# EAGLE design haasoscope_pro_power_board (EAGLE 9.6.2)
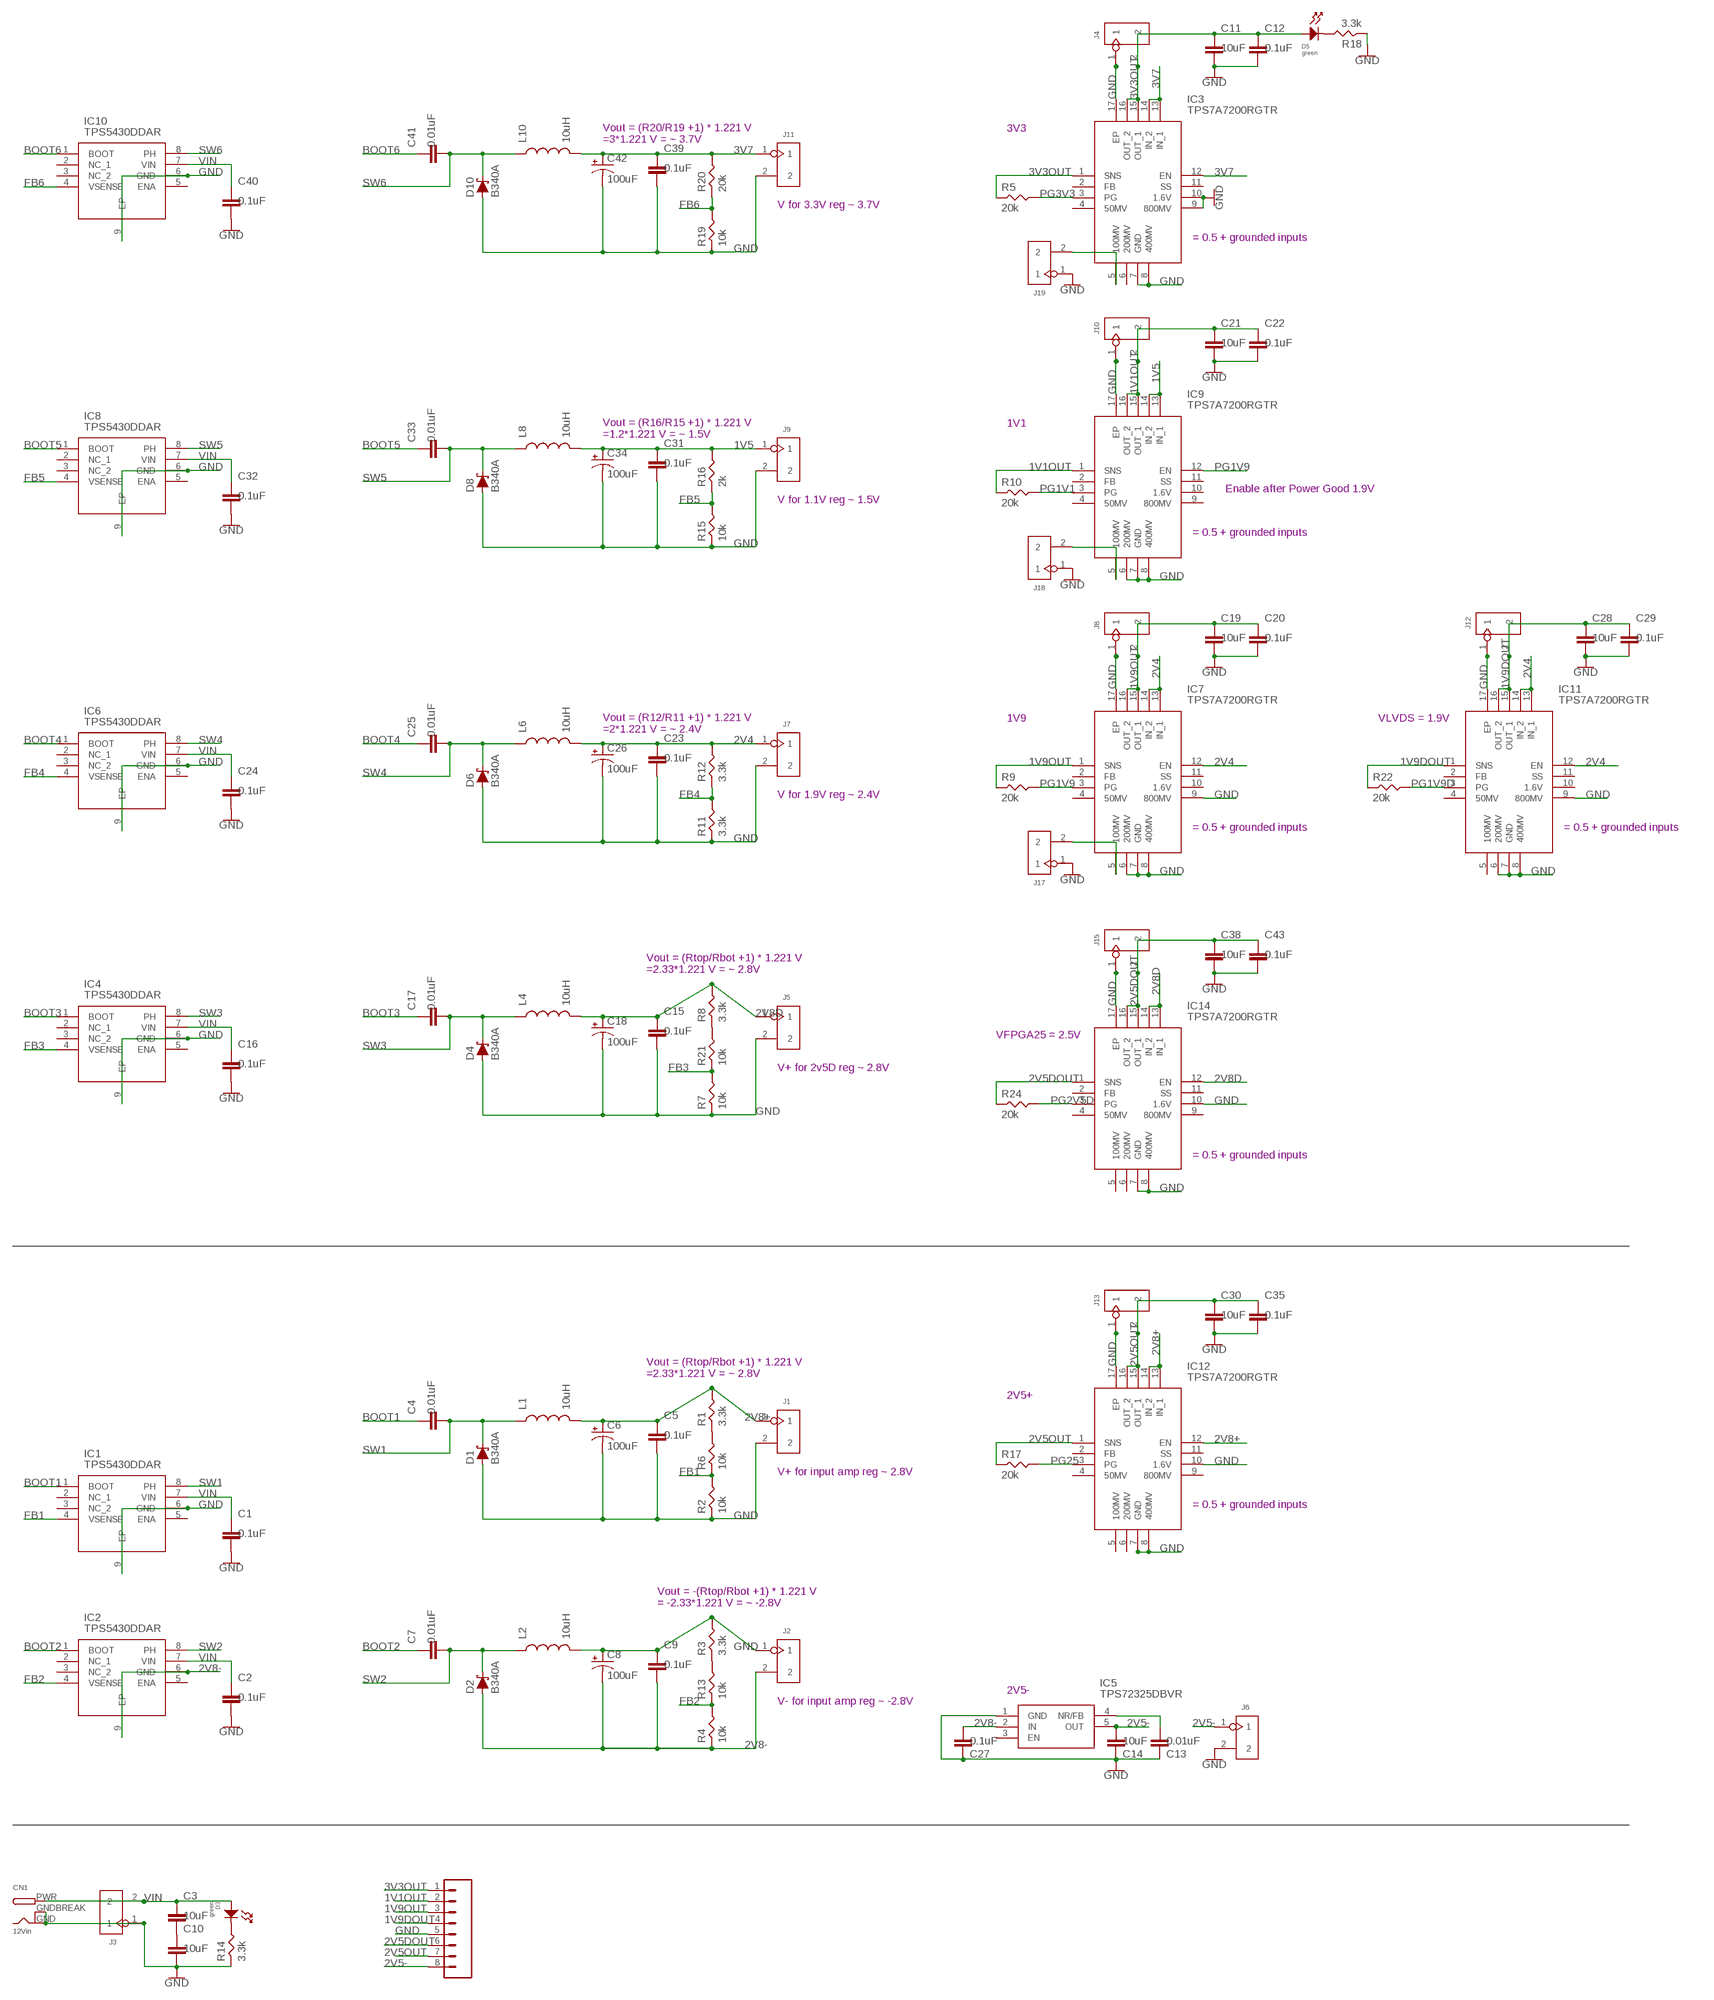
[diagram p0: schematic, sheet 1]

## Parts
C1  0.1uF  CAPACITOR_0402_N  [RESC0402_N]
C2  0.1uF  CAPACITOR_0402_N  [RESC0402_N]
C3  10uF  CAPACITOR_0805_N  [RESC0805_N]
C4  0.01uF  CAPACITOR_0402_N  [RESC0402_N]
C5  0.1uF  CAPACITOR_0402_N  [RESC0402_N]
C6  100uF  CAP_POLSMD  [VISHAY_C]
C7  0.01uF  CAPACITOR_0402_N  [RESC0402_N]
C8  100uF  CAP_POLSMD  [VISHAY_C]
C9  0.1uF  CAPACITOR_0402_N  [RESC0402_N]
C10  10uF  CAPACITOR_0805_N  [RESC0805_N]
C11  10uF  CAPACITOR_0805_N  [RESC0805_N]
C12  0.1uF  CAPACITOR_0402_N  [RESC0402_N]
C13  0.01uF  CAPACITOR_0402_N  [RESC0402_N]
C14  10uF  CAPACITOR_0805_N  [RESC0805_N]
C15  0.1uF  CAPACITOR_0402_N  [RESC0402_N]
C16  0.1uF  CAPACITOR_0402_N  [RESC0402_N]
C17  0.01uF  CAPACITOR_0402_N  [RESC0402_N]
C18  100uF  CAP_POLSMD  [VISHAY_C]
C19  10uF  CAPACITOR_0805_N  [RESC0805_N]
C20  0.1uF  CAPACITOR_0402_N  [RESC0402_N]
C21  10uF  CAPACITOR_0805_N  [RESC0805_N]
C22  0.1uF  CAPACITOR_0402_N  [RESC0402_N]
C23  0.1uF  CAPACITOR_0402_N  [RESC0402_N]
C24  0.1uF  CAPACITOR_0402_N  [RESC0402_N]
C25  0.01uF  CAPACITOR_0402_N  [RESC0402_N]
C26  100uF  CAP_POLSMD  [VISHAY_C]
C27  0.1uF  CAPACITOR_0402_N  [RESC0402_N]
C28  10uF  CAPACITOR_0805_N  [RESC0805_N]
C29  0.1uF  CAPACITOR_0402_N  [RESC0402_N]
C30  10uF  CAPACITOR_0805_N  [RESC0805_N]
C31  0.1uF  CAPACITOR_0402_N  [RESC0402_N]
C32  0.1uF  CAPACITOR_0402_N  [RESC0402_N]
C33  0.01uF  CAPACITOR_0402_N  [RESC0402_N]
C34  100uF  CAP_POLSMD  [VISHAY_C]
C35  0.1uF  CAPACITOR_0402_N  [RESC0402_N]
C38  10uF  CAPACITOR_0805_N  [RESC0805_N]
C39  0.1uF  CAPACITOR_0402_N  [RESC0402_N]
C40  0.1uF  CAPACITOR_0402_N  [RESC0402_N]
C41  0.01uF  CAPACITOR_0402_N  [RESC0402_N]
C42  100uF  CAP_POLSMD  [VISHAY_C]
C43  0.1uF  CAPACITOR_0402_N  [RESC0402_N]
CN1  12Vin  DCBARRELPTH  [DCJACK_2MM_PTH]
D1  B340A  DIODE-SCHOTTKY-B340A  [SMA-DIODE]
D2  B340A  DIODE-SCHOTTKY-B340A  [SMA-DIODE]
D3  green  LED_SINGLE-0805  [LED0805]
D4  B340A  DIODE-SCHOTTKY-B340A  [SMA-DIODE]
D5  green  LED_SINGLE-0805  [LED0805]
D6  B340A  DIODE-SCHOTTKY-B340A  [SMA-DIODE]
D8  B340A  DIODE-SCHOTTKY-B340A  [SMA-DIODE]
D10  B340A  DIODE-SCHOTTKY-B340A  [SMA-DIODE]
IC1  TPS5430DDAR  [SOIC127P600X170-9N]
IC2  TPS5430DDAR  [SOIC127P600X170-9N]
IC3  TPS7A7200RGTR  [QFN50P300X300X100-17N]
IC4  TPS5430DDAR  [SOIC127P600X170-9N]
IC5  TPS72325DBVR  [SOT95P280X145-5N]
IC6  TPS5430DDAR  [SOIC127P600X170-9N]
IC7  TPS7A7200RGTR  [QFN50P300X300X100-17N]
IC8  TPS5430DDAR  [SOIC127P600X170-9N]
IC9  TPS7A7200RGTR  [QFN50P300X300X100-17N]
IC10  TPS5430DDAR  [SOIC127P600X170-9N]
IC11  TPS7A7200RGTR  [QFN50P300X300X100-17N]
IC12  TPS7A7200RGTR  [QFN50P300X300X100-17N]
IC14  TPS7A7200RGTR  [QFN50P300X300X100-17N]
J1  2p-2.54  DIP-BLACK-MALE-HEADER-VERT(2P-2.54)  [H2-2.54]
J2  2p-2.54  DIP-BLACK-MALE-HEADER-VERT(2P-2.54)  [H2-2.54]
J3  2p-2.54  DIP-BLACK-MALE-HEADER-VERT(2P-2.54)  [H2-2.54]
J4  2p-2.54  DIP-BLACK-MALE-HEADER-VERT(2P-2.54)  [H2-2.54]
J5  2p-2.54  DIP-BLACK-MALE-HEADER-VERT(2P-2.54)  [H2-2.54]
J6  2p-2.54  DIP-BLACK-MALE-HEADER-VERT(2P-2.54)  [H2-2.54]
J7  2p-2.54  DIP-BLACK-MALE-HEADER-VERT(2P-2.54)  [H2-2.54]
J8  2p-2.54  DIP-BLACK-MALE-HEADER-VERT(2P-2.54)  [H2-2.54]
J9  2p-2.54  DIP-BLACK-MALE-HEADER-VERT(2P-2.54)  [H2-2.54]
J10  2p-2.54  DIP-BLACK-MALE-HEADER-VERT(2P-2.54)  [H2-2.54]
J11  2p-2.54  DIP-BLACK-MALE-HEADER-VERT(2P-2.54)  [H2-2.54]
J12  2p-2.54  DIP-BLACK-MALE-HEADER-VERT(2P-2.54)  [H2-2.54]
J13  2p-2.54  DIP-BLACK-MALE-HEADER-VERT(2P-2.54)  [H2-2.54]
J15  2p-2.54  DIP-BLACK-MALE-HEADER-VERT(2P-2.54)  [H2-2.54]
J16  8pin  CONN_08"  [1X08]
J17  2p-2.54  DIP-BLACK-MALE-HEADER-VERT(2P-2.54)  [H2-2.54]
J18  2p-2.54  DIP-BLACK-MALE-HEADER-VERT(2P-2.54)  [H2-2.54]
J19  2p-2.54  DIP-BLACK-MALE-HEADER-VERT(2P-2.54)  [H2-2.54]
L1  10uH  INDUCTORPWR  [CDRH125]
L2  10uH  INDUCTORPWR  [CDRH125]
L4  10uH  INDUCTORPWR  [CDRH125]
L6  10uH  INDUCTORPWR  [CDRH125]
L8  10uH  INDUCTORPWR  [CDRH125]
L10  10uH  INDUCTORPWR  [CDRH125]
R1  3.3k  RES-0402  [RES-0402]
R2  10k  RES-0402  [RES-0402]
R3  3.3k  RES-0402  [RES-0402]
R4  10k  RES-0402  [RES-0402]
R5  20k  RES-0402  [RES-0402]
R6  10k  RES-0402  [RES-0402]
R7  10k  RES-0402  [RES-0402]
R8  3.3k  RES-0402  [RES-0402]
R9  20k  RES-0402  [RES-0402]
R10  20k  RES-0402  [RES-0402]
R11  3.3k  RES-0402  [RES-0402]
R12  3.3k  RES-0402  [RES-0402]
R13  10k  RES-0402  [RES-0402]
R14  3.3k  RES-0402  [RES-0402]
R15  10k  RES-0402  [RES-0402]
R16  2k  RES-0402  [RES-0402]
R17  20k  RES-0402  [RES-0402]
R18  3.3k  RES-0402  [RES-0402]
R19  10k  RES-0402  [RES-0402]
R20  20k  RES-0402  [RES-0402]
R21  10k  RES-0402  [RES-0402]
R22  20k  RES-0402  [RES-0402]
R24  20k  RES-0402  [RES-0402]

## Nets
1V1OUT: C21.1 C22.1 IC9.1(SNS) IC9.15(OUT_1) IC9.16(OUT_2) J10.2 J16.2 R10.P$1
1V5: C31.1 C34.+ IC9.13(IN_1) IC9.14(IN_2) J9.1 L8.2 R16.P$2
1V9DOUT: C28.1 C29.1 IC11.1(SNS) IC11.15(OUT_1) IC11.16(OUT_2) J12.2 J16.4 R22.P$1
1V9OUT: C19.1 C20.1 IC7.1(SNS) IC7.15(OUT_1) IC7.16(OUT_2) J8.2 J16.3 R9.P$1
2V4: C23.1 C26.+ IC7.12(EN) IC7.13(IN_1) IC7.14(IN_2) IC11.12(EN) IC11.13(IN_1) IC11.14(IN_2) J7.1 L6.2 R12.P$2
2V5-: C14.1 IC5.5(OUT) J6.1 J16.8
2V5DOUT: C38.1 C43.1 IC14.1(SNS) IC14.15(OUT_1) IC14.16(OUT_2) J15.2 J16.6 R24.P$1
2V5OUT: C30.1 C35.1 IC12.1(SNS) IC12.15(OUT_1) IC12.16(OUT_2) J13.2 J16.7 R17.P$1
2V8+: C5.1 C6.+ IC12.12(EN) IC12.13(IN_1) IC12.14(IN_2) J1.1 L1.2 R1.P$2
2V8-: C8.- C9.2 C27.1 D2.A IC2.6(GND) IC2.9(EP) IC5.2(IN) J2.2 R4.P$1
2V8D: C15.1 C18.+ IC14.12(EN) IC14.13(IN_1) IC14.14(IN_2) J5.1 L4.2 R8.P$2
3V3OUT: C11.1 C12.1 D5.ANODE IC3.1(SNS) IC3.15(OUT_1) IC3.16(OUT_2) J4.2 J16.1 R5.P$1
3V7: C39.1 C42.+ IC3.12(EN) IC3.13(IN_1) IC3.14(IN_2) J11.1 L10.2 R20.P$2
BOOT1: C4.1 IC1.1(BOOT)
BOOT2: C7.1 IC2.1(BOOT)
BOOT3: C17.1 IC4.1(BOOT)
BOOT4: C25.1 IC6.1(BOOT)
BOOT5: C33.1 IC8.1(BOOT)
BOOT6: C41.1 IC10.1(BOOT)
FB1: IC1.4(VSENSE) R2.P$2 R6.P$1
FB2: IC2.4(VSENSE) R4.P$2 R13.P$1
FB3: IC4.4(VSENSE) R7.P$2 R21.P$1
FB4: IC6.4(VSENSE) R11.P$2 R12.P$1
FB5: IC8.4(VSENSE) R15.P$2 R16.P$1
FB6: IC10.4(VSENSE) R19.P$2 R20.P$1
GND: C1.2 C2.2 C5.2 C6.- C8.+ C9.1 C10.2 C11.2 C12.2 C13.2 C14.2 C15.2 C16.2 C18.- C19.2 C20.2 C21.2 C22.2 C23.2 C24.2 C26.- C27.2 C28.2 C29.2 C30.2 C31.2 C32.2 C34.- C35.2 C38.2 C39.2 C40.2 C42.- C43.2 CN1.GND CN1.GNDBREAK D1.A D4.A D6.A D8.A D10.A IC1.6(GND) IC1.9(EP) IC3.7(GND) IC3.8(400MV) IC3.9(800MV) IC3.10(1.6V) IC3.17(EP) IC4.6(GND) IC4.9(EP) IC5.1(GND) IC6.6(GND) IC6.9(EP) IC7.6(200MV) IC7.7(GND) IC7.8(400MV) IC7.9(800MV) IC7.17(EP) IC8.6(GND) IC8.9(EP) IC9.6(200MV) IC9.7(GND) IC9.8(400MV) IC9.17(EP) IC10.6(GND) IC10.9(EP) IC11.6(200MV) IC11.7(GND) IC11.8(400MV) IC11.9(800MV) IC11.17(EP) IC12.7(GND) IC12.8(400MV) IC12.10(1.6V) IC12.17(EP) IC14.7(GND) IC14.8(400MV) IC14.10(1.6V) IC14.17(EP) J1.2 J2.1 J3.1 J4.1 J5.2 J6.2 J7.2 J8.1 J9.2 J10.1 J11.2 J12.1 J13.1 J15.1 J16.5 J17.1 J18.1 J19.1 L2.2 R2.P$1 R3.P$2 R7.P$1 R11.P$1 R14.P$1 R15.P$1 R18.P$1 R19.P$1
N$1: R1.P$1 R6.P$2
N$2: R3.P$1 R13.P$2
N$3: C3.2 C10.1
N$4: C13.1 IC5.4(NR/FB)
N$5: D3.CATHODE R14.P$2
N$6: D5.CATHODE R18.P$2
N$7: R8.P$1 R21.P$2
N$8: IC3.5(100MV) J19.2
N$9: IC9.5(100MV) J18.2
N$10: IC7.5(100MV) J17.2
PG1V1: IC9.3(PG) R10.P$2
PG1V9: IC7.3(PG) IC9.12(EN) R9.P$2
PG1V9D: IC11.3(PG) R22.P$2
PG2V5D: IC14.3(PG) R24.P$2
PG3V3: IC3.3(PG) R5.P$2
PG25: IC12.3(PG) R17.P$2
SW1: C4.2 D1.C IC1.8(PH) L1.1
SW2: C7.2 D2.C IC2.8(PH) L2.1
SW3: C17.2 D4.C IC4.8(PH) L4.1
SW4: C25.2 D6.C IC6.8(PH) L6.1
SW5: C33.2 D8.C IC8.8(PH) L8.1
SW6: C41.2 D10.C IC10.8(PH) L10.1
VIN: C1.1 C2.1 C3.1 C16.1 C24.1 C32.1 C40.1 CN1.PWR D3.ANODE IC1.7(VIN) IC2.7(VIN) IC4.7(VIN) IC6.7(VIN) IC8.7(VIN) IC10.7(VIN) J3.2
Unconnected: IC1.2(NC_1) IC1.3(NC_2) IC1.5(ENA) IC2.2(NC_1) IC2.3(NC_2) IC2.5(ENA) IC3.2(FB) IC3.4(50MV) IC3.6(200MV) IC3.11(SS) IC4.2(NC_1) IC4.3(NC_2) IC4.5(ENA) IC5.3(EN) IC6.2(NC_1) IC6.3(NC_2) IC6.5(ENA) IC7.2(FB) IC7.4(50MV) IC7.10(1.6V) IC7.11(SS) IC8.2(NC_1) IC8.3(NC_2) IC8.5(ENA) IC9.2(FB) IC9.4(50MV) IC9.9(800MV) IC9.10(1.6V) IC9.11(SS) IC10.2(NC_1) IC10.3(NC_2) IC10.5(ENA) IC11.2(FB) IC11.4(50MV) IC11.5(100MV) IC11.10(1.6V) IC11.11(SS) IC12.2(FB) IC12.4(50MV) IC12.5(100MV) IC12.6(200MV) IC12.9(800MV) IC12.11(SS) IC14.2(FB) IC14.4(50MV) IC14.5(100MV) IC14.6(200MV) IC14.9(800MV) IC14.11(SS)

## Notes on the sheet
- 3V3
- Vout = (R20/R19 +1) * 1.221 V
  =3*1.221 V = ~ 3.7V
- V for 3.3V reg ~ 3.7V
- = 0.5 + grounded inputs
- 1V1
- Vout = (R16/R15 +1) * 1.221 V
  =1.2*1.221 V = ~ 1.5V
- Enable after Power Good 1.9V
- V for 1.1V reg ~ 1.5V
- = 0.5 + grounded inputs
- 1V9 | VLVDS = 1.9V
- Vout = (R12/R11 +1) * 1.221 V
  =2*1.221 V = ~ 2.4V
- V for 1.9V reg ~ 2.4V
- = 0.5 + grounded inputs | = 0.5 + grounded inputs
- Vout = (Rtop/Rbot +1) * 1.221 V
  =2.33*1.221 V = ~ 2.8V
- VFPGA25 = 2.5V
- V+ for 2v5D reg ~ 2.8V
- = 0.5 + grounded inputs
- Vout = (Rtop/Rbot +1) * 1.221 V
  =2.33*1.221 V = ~ 2.8V
- 2V5+
- V+ for input amp reg ~ 2.8V
- = 0.5 + grounded inputs
- Vout = -(Rtop/Rbot +1) * 1.221 V
  = -2.33*1.221 V = ~ -2.8V
- 2V5-
- V- for input amp reg ~ -2.8V

## Library data of the parts
C1-C5 C7 C9-C17 C19-C25 C27-C33 C35 C38-C41 C43 = Nordic_nRF:CAPACITOR: Generic chip capacitor
C6 C8 C18 C26 C34 C42 = SparkFun-Passives:CAP_POL: Capacitor Polarized These are standard SMD and PTH capacitors. Normally 10uF, 47uF, and 100uF in electrolytic and tantalum varieties. Always verify the external diameter of the through hole cap, it varies with capacity, voltage, and manufacturer. The EIA devices should be standard.; LCSC: C7230
CN1 = adafruit:DCBARREL: 2.0mm DC Barrel Jack DCJACK_2MM_PTH - Through Hole Jack (4UConnector: 05537)
D1 D2 D4 D6 D8 D10 = SparkFun-DiscreteSemi:DIODE-SCHOTTKY: Schottky diode A Schottky diode is a semiconductor diode which has a low forward voltage drop and a very fast switching action.; LCSC: C64982; PROD_ID: DIO-09886; VALUE: 3A/40V/500mV
D3 D5 = MF_LEDs:LED_SINGLE: Library: MF_LEDs Description: Device for Single LED Packages. Manufacture part number (MFG#) can be added via Attributes.; HOUSEPART: NO; POPULATE: 1
IC1 IC2 IC4 IC6 IC8 IC10 = TPS5430DDAR:TPS5430DDAR: Texas Instruments, TPS5430DDAR Step-Down Switching Regulator 3A Adjustable, 1.22 31 V, 8-Pin SOIC Source: Datasheet <http://www.ti.com/lit/gpn/tps5430>; DESCRIPTION: Texas Instruments, TPS5430DDAR Step-Down Switching Regulator 3A Adjustable, 1.22 31 V, 8-Pin SOIC; HEIGHT: 1.7mm; MANUFACTURER_NAME: Texas Instruments; MANUFACTURER_PART_NUMBER: TPS5430DDAR; MOUSER_PART_NUMBER: 595-TPS5430DDAR; MOUSER_PRICE-STOCK: https://www.mouser.co.uk/ProductDetail/Texas-Instruments/TPS5430DDAR?qs=zwk82MlA57ZJdOTovH1aYA%3D%3D
IC3 IC7 IC9 IC11 IC12 IC14 = TPS7A7200RGTR:TPS7A7200RGTR: 2A, Single Output, Very Low Input, Configurable Fixed (0.9 to 5.0V) Low-Dropout Linear Regulator Source: Datasheet <http://www.ti.com/lit/gpn/tps7a7200>; DESCRIPTION: 2A, Single Output, Very Low Input, Configurable Fixed (0.9 to 5.0V) Low-Dropout Linear Regulator; HEIGHT: 1mm; MANUFACTURER_NAME: Texas Instruments; MANUFACTURER_PART_NUMBER: TPS7A7200RGTR; MOUSER_PART_NUMBER: 595-TPS7A7200RGTR; MOUSER_PRICE-STOCK: https://www.mouser.co.uk/ProductDetail/Texas-Instruments/TPS7A7200RGTR?qs=N%2FGwOzoYEADhZqusv3bivA%3D%3D
IC5 = TPS72325DBVR:TPS72325DBVR: TEXAS INSTRUMENTS - TPS72325DBVR - LDO, FIXED, -2.5V, 0.2A, SOT-23-5 Source: Datasheet <https://datasheet.datasheetarchive.com/originals/distributors/Datasheets-SFU2/DSASFU100034060.pdf>; DESCRIPTION: TEXAS INSTRUMENTS - TPS72325DBVR - LDO, FIXED, -2.5V, 0.2A, SOT-23-5; HEIGHT: 1.45mm; MANUFACTURER_NAME: Texas Instruments; MANUFACTURER_PART_NUMBER: TPS72325DBVR; MOUSER_PART_NUMBER: 595-TPS72325DBVR; MOUSER_PRICE-STOCK: https://www.mouser.co.uk/ProductDetail/Texas-Instruments/TPS72325DBVR?qs=6zVL%252ByCp0mrCtYCk6%2F08lw%3D%3D
J1-J13 J15 J17-J19 = Seeed-Connector:DIP-BLACK-MALE-HEADER-VERT(2P-2.54): 320020016; MPN: P125-1102A0BS116A1
J16 = SparkFun-Connectors:CONN_08: Multi connection point. Often used as Generic Header-pin footprint for 0.1 inch spaced/style header connections On any of the 0.1 inch spaced packages, you can populate with these: Break Away Headers - Straight <https://www.sparkfun.com/products/116> (PRT-00116) Break Away Male Headers - Right Angle <https://www.sparkfun.com/products/553> (PRT-00553) Female Headers <https://www.sparkfun.com/products/115> (PRT-00115) Break Away Headers - Machine Pin <https://www.sparkfun.com/products/117> (PRT-00117) Break Away Female Headers - Swiss Machine Pin <https://www.sparkfun.com/products/743> (PRT-00743) Arduino Stackable Header - 8 Pin <https://www.sparkfun.com/products/9279> (PRT-09279) For SCREWTERMINALS and SPRING TERMINALS visit here: Screw Terimnals on SparkFun.com <https://www.sparkfun.com/search/results?term=Screw+Terminals> (5mm/3.5mm/2.54mm spacing) This device is also useful as a general connection point to wire up your design to another part of your project. Our various solder wires solder well into these plated through hole pads. Hook-Up Wire - Assortment (Stranded, 22 AWG) <https://www.sparkfun.com/products/11375> (PRT-11375) Hook-Up Wire - Assortment (Solid Core, 22 AWG) <https://www.sparkfun.com/products/11367> (PRT-11367) View the entire wire category on our website here <https://www.sparkfun.com/categories/141> Special notes: Molex polarized connector foot print use with SKU : PRT-08231 with associated crimp pins and housings. 1MM SMD Version SKU: PRT-10208 NOTES ON THE VARIANTS LOCK and LOCK_LONGPADS... This footprint was designed to help hold the alignment of a through-hole component (i.e. 6-pin header) while soldering it into place. You may notice that each hole has been shifted either up or down by 0.005 of an inch from it's more standard position (which is a perfectly straight line). This slight alteration caused the pins (the squares in the middle) to touch the edges of the holes. Because they are alternating, it causes a "brace" to hold the component in place. 0.005 has proven to be the perfect amount of "off-center" position when using our standard breakaway headers. Although looks a little odd when you look at the bare footprint, once you have a header in there, the alteration is very hard to notice. Also,if you push a header all the way into place, it is covered up entirely on the bottom side.; PROD_ID: CONN-08438
L1 L2 L4 L6 L8 L10 = SparkFun-Passives:INDUCTOR: Inductors Basic Inductor/Choke - 0603 and 1206. Footprints are not proven and vary greatly between part numbers. INDUCTOR POWER 3.3UH 4.0A SMD 0.197" L x 0.197" W x 0.177" H (5.00mm x 5.00mm x 4.50mm); LCSC: C339970
R1-R22 R24 = FlashPCB_Resistors:RES-0402: https://www.digikey.com/en/products/filter/chip-resistor-surface-mount/52?s=N4IgjCBcpgbFoDGUBmBDANgZwKYBoQB7KAbRAGYBOAJgBZ4BdAgBwBcoQBlVgJwEsAdgHMQAX1EFqpEDxxY%2BWVoR4gGooA

## Net classes
0 default: width 0.305 mm
1 power: width 0.406 mm
2 gnd: width 0.305 mm

## Board
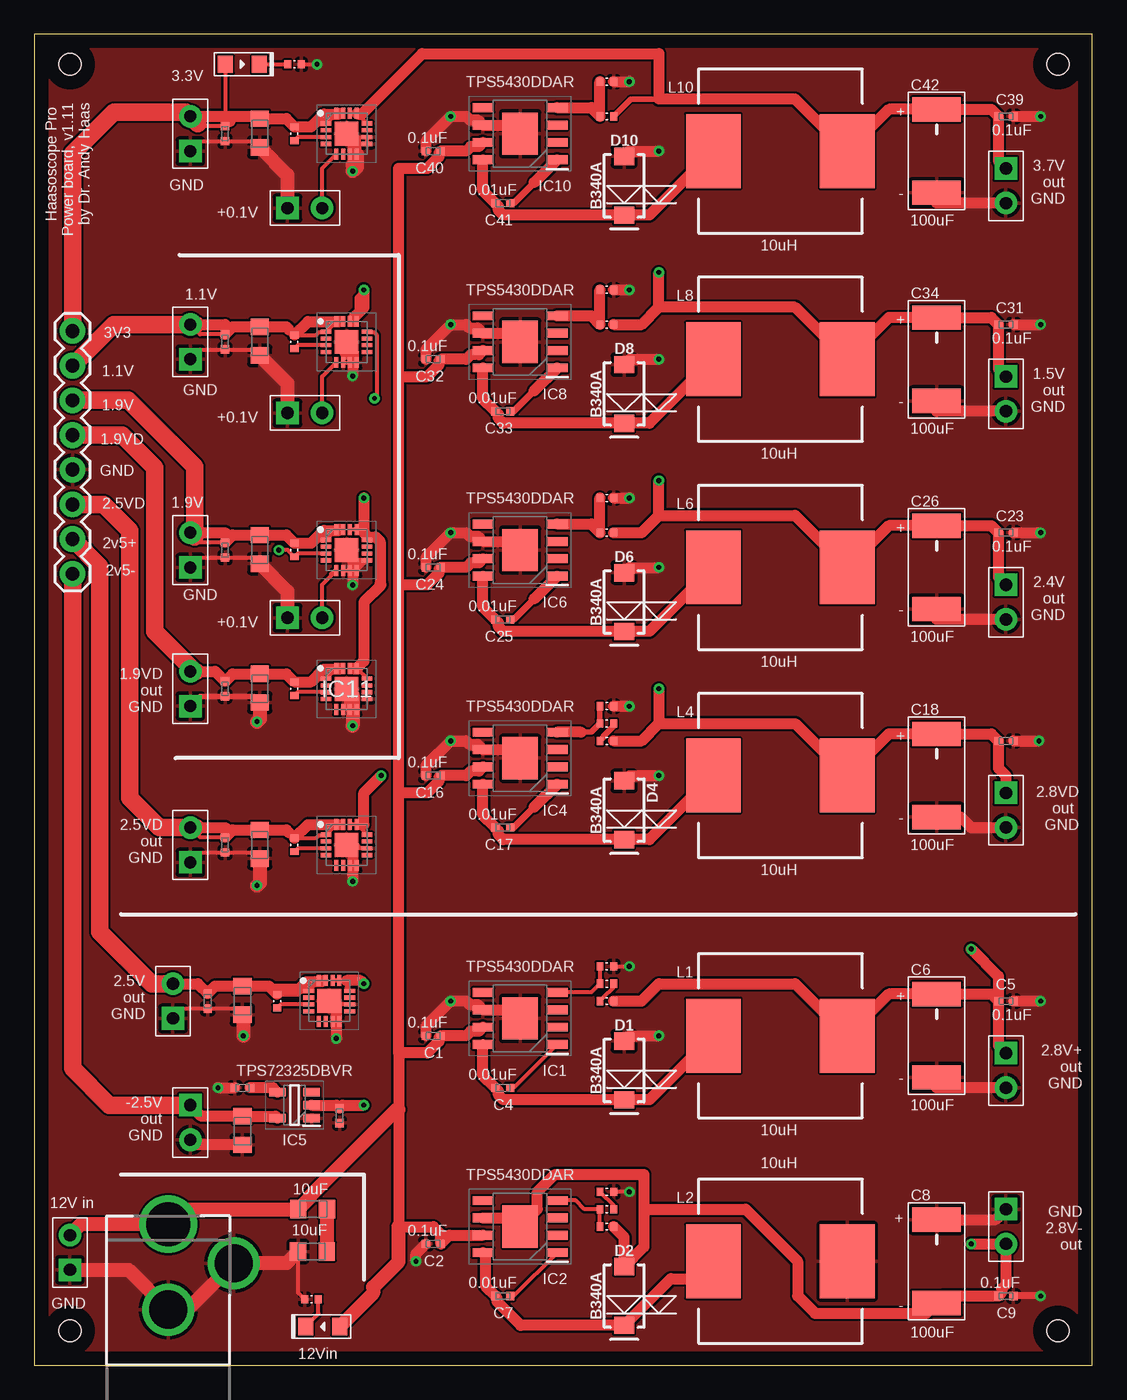
[diagram p1: board, top side]
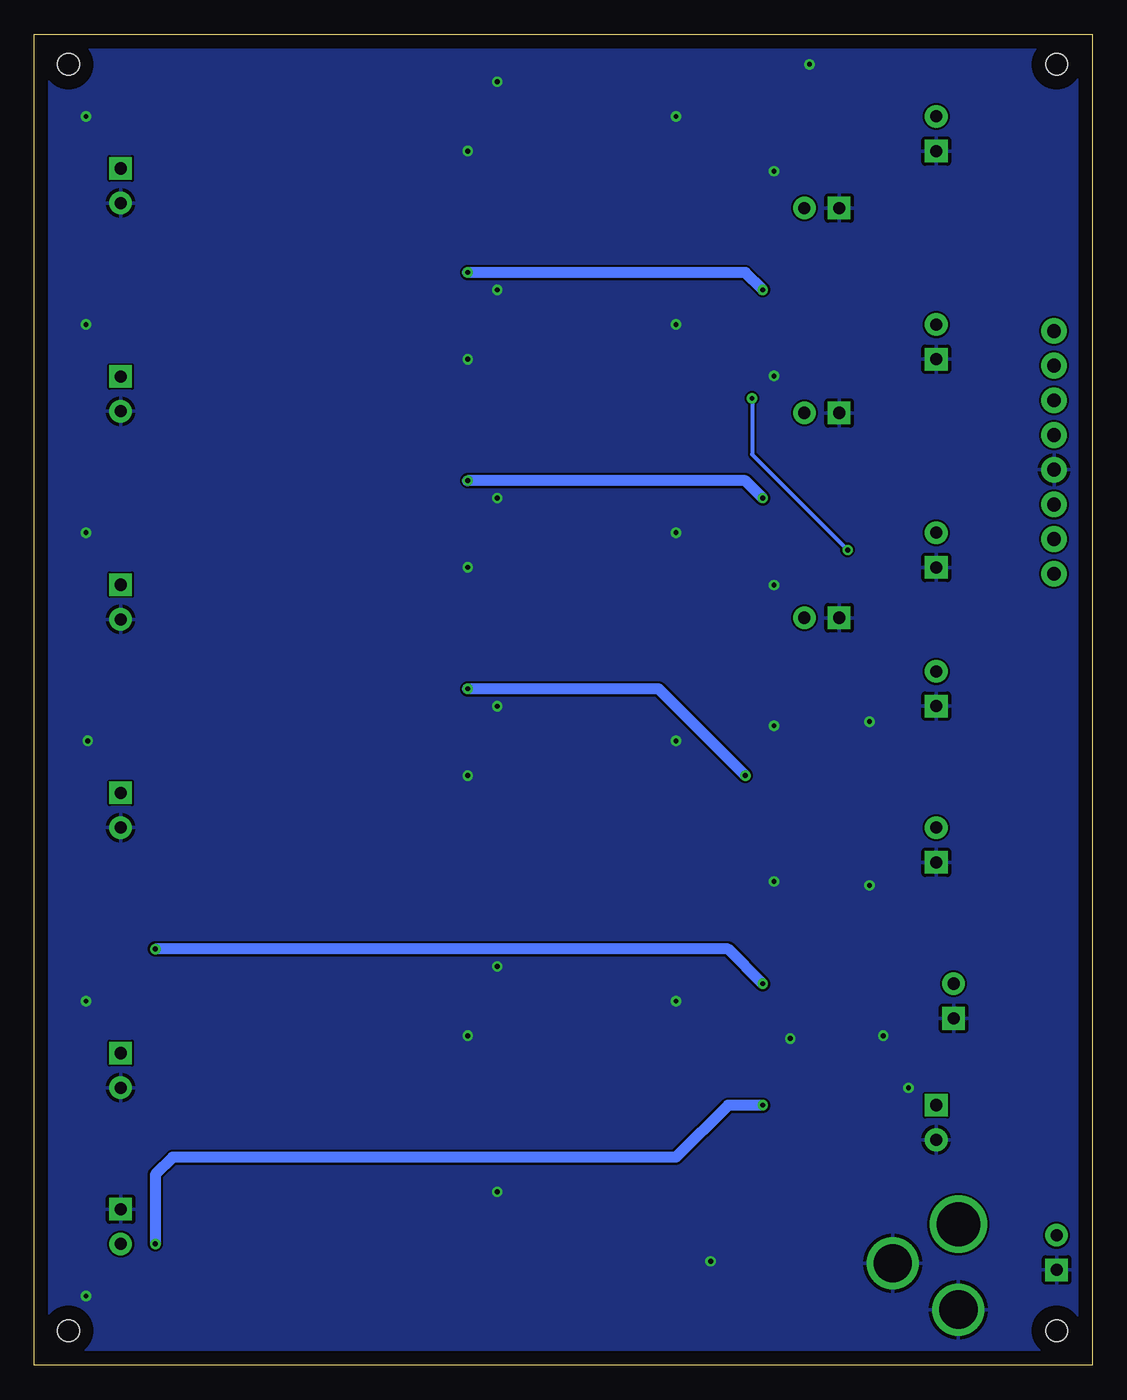
[diagram p2: board, bottom side, seen from below]

Size 77.45 x 97.46 mm. Coordinates in mm from the lower left corner, seen from the top.
Outline: 0,0 77.45,0 77.45,97.46 0,97.46 0,0
Copper layers (1*16): Top 0.035mm / dielectric 1.5mm / Bottom 0.035mm
Design rules "default": minimum track width 6mil, minimum drill 0.35mm, track to track 6mil, track to pad 6mil, pad to pad 6mil, via to via 6mil, smd to smd 6mil, copper to edge 40mil, drill to drill 6mil, minimum pad ring 10mil, minimum via ring 8mil, stop-mask expansion 4mil, vias tented up to drill 0mil, thermal gap 10mil
Holes 1.6 mm at 2.62,95.25 2.62,2.54 74.93,2.54 74.93,95.25

### Footprints (pad centres in the part's own frame; a part is rotated, then mirrored left to right if it is on the bottom)
RESC0402_N = smd 0.6 x 0.6: 1 -0.55,0; 2 0.55,0
RESC0805_N = smd 1.2 x 1.35: 1 -1.1,0; 2 1,0
VISHAY_C = smd 3.556 x 1.778: + 0,3.048; - 0,-3.048
DCJACK_2MM_PTH = drill 2.8: GND 0,7.35; GNDBREAK 4.8,10.75 | drill 3.2: PWR 0,13.6
SMA-DIODE = smd 1.27 x 1.47: A -2.15,0; C 2.15,0
LED0805 = smd 1.1 x 1.25: ANODE 1.25,0; CATHODE -1.25,0
SOIC127P600X170-9N = smd 1.525 x 0.65: 1 -2.712,1.905; 2 -2.712,0.635; 3 -2.712,-0.635; 4 -2.712,-1.905; 5 2.712,-1.905; 6 2.712,-0.635; 7 2.712,0.635; 8 2.712,1.905 | smd 2.6 x 3.1: 9 0,0
QFN50P300X300X100-17N = smd 0.8 x 0.3: 1 -1.5,0.75; 2 -1.5,0.25; 3 -1.5,-0.25; 4 -1.5,-0.75; 9 1.5,-0.75; 10 1.5,-0.25; 11 1.5,0.25; 12 1.5,0.75 | smd 0.3 x 0.8: 5 -0.75,-1.5; 6 -0.25,-1.5; 7 0.25,-1.5; 8 0.75,-1.5; 13 0.75,1.5; 14 0.25,1.5; 15 -0.25,1.5; 16 -0.75,1.5 | smd 1.75 x 1.75: 17 0,0
SOT95P280X145-5N = smd 1.2 x 0.6: 1 -1.25,0.95; 2 -1.25,0; 3 -1.25,-0.95; 4 1.25,-0.95; 5 1.25,0.95
H2-2.54 = drill 0.889 pad 1.651 square: 1 0,1.27 | drill 0.889 pad 1.651: 2 0,-1.27
1X08 = drill 1.016 pad 1.88: 1 0,0; 2 2.54,0; 3 5.08,0; 4 7.62,0; 5 10.16,0; 6 12.7,0; 7 15.24,0; 8 17.78,0
CDRH125 = smd 5.4 x 4: 1 0,4.9; 2 0,-4.9
RES-0402 = smd 0.5 x 0.6: P$1 -0.5,0; P$2 0.5,0

### Placement (x,y rotation side)
C1  29.21,24.13 180 top
C2  29.21,8.89 180 top
C3  20.43,11.43 0 top
C4  34.29,20.32 180 top
C5  71.12,26.67 0 top
C6  66.04,24.13 0 top
C7  34.29,5.08 180 top
C8  66.04,7.62 0 top
C9  71.12,5.08 180 top
C10  20.31,8.33 180 top
C11  16.51,90.17 270 top
C12  13.97,90.17 270 top
C13  15.24,20.32 180 top
C14  15.24,17.14 270 top
C15  71.12,45.72 0 top
C16  29.21,43.18 180 top
C17  34.29,39.37 180 top
C18  66.04,43.18 0 top
C19  16.51,59.69 270 top
C20  13.97,59.69 270 top
C21  16.51,74.93 270 top
C22  13.97,74.93 270 top
C23  71.12,60.96 0 top
C24  29.21,58.42 180 top
C25  34.29,54.61 180 top
C26  66.04,58.42 0 top
C27  22.35,18.29 270 top
C28  16.51,49.53 270 top
C29  13.97,49.53 270 top
C30  15.24,26.67 270 top
C31  71.12,76.2 0 top
C32  29.21,73.66 180 top
C33  34.29,69.85 180 top
C34  66.04,73.66 0 top
C35  12.7,26.67 270 top
C38  16.51,38.1 270 top
C39  71.12,91.44 0 top
C40  29.21,88.9 180 top
C41  34.29,85.09 180 top
C42  66.04,88.9 0 top
C43  13.97,38.1 270 top
CN1  9.81,-3.27 0 top
D1  43.18,21.59 270 top
D2  43.18,5.08 270 top
D3  21.11,2.84 0 top
D4  43.18,40.64 270 top
D5  15.24,95.25 180 top
D6  43.18,55.88 270 top
D8  43.18,71.12 270 top
D10  43.18,86.36 270 top
IC1  35.56,25.4 180 top
IC2  35.56,10.16 180 top
IC3  22.86,90.17 0 top
IC4  35.56,44.45 180 top
IC5  19.05,19.05 180 top
IC6  35.56,59.69 180 top
IC7  22.86,59.69 0 top
IC8  35.56,74.93 180 top
IC9  22.86,74.93 0 top
IC10  35.56,90.17 180 top
IC11  22.86,49.53 0 top
IC12  21.59,26.67 0 top
IC14  22.86,38.1 0 top
J1  71.12,21.59 0 top
J2  71.12,10.16 0 top
J3  2.62,8.26 180 top
J4  11.43,90.17 180 top
J5  71.12,40.64 0 top
J6  11.43,17.78 0 top
J7  71.12,55.88 0 top
J8  11.43,59.69 180 top
J9  71.12,71.12 0 top
J10  11.43,74.93 180 top
J11  71.12,86.36 0 top
J12  11.43,49.53 180 top
J13  10.16,26.67 180 top
J15  11.43,38.1 180 top
J16  2.81,75.73 270 top
J17  19.81,54.73 90 top
J18  19.81,69.73 90 top
J19  19.81,84.73 90 top
L1  54.61,24.13 90 top
L2  54.61,7.62 90 top
L4  54.61,43.18 90 top
L6  54.61,58.42 90 top
L8  54.61,73.66 90 top
L10  54.61,88.9 90 top
R1  41.91,26.67 0 top
R2  41.91,29.21 180 top
R3  41.91,12.7 0 top
R4  41.91,10.16 180 top
R5  19.05,90.17 270 top
R6  41.91,27.94 0 top
R7  41.91,48.26 180 top
R8  41.91,45.72 0 top
R9  19.05,59.69 270 top
R10  19.05,74.93 270 top
R11  41.91,63.5 180 top
R12  41.91,60.96 0 top
R13  41.91,11.43 0 top
R14  20.3,4.84 0 top
R15  41.91,78.74 180 top
R16  41.91,76.2 0 top
R17  17.78,26.67 270 top
R18  19.05,95.25 180 top
R19  41.91,93.98 180 top
R20  41.91,91.44 0 top
R21  41.91,46.99 0 top
R22  19.05,49.53 270 top
R24  19.05,38.1 270 top

### Tracks (layer width: path | path; a pad name or v marks a point on that pad's centre or on a via)
1V1OUT
  Top 0.305: 18.66,75.81 R10.P$1 20.63,75.43 20.83,75.64 21.31,75.64 IC9.1 IC9.16 22.36,76.43 IC9.15 | 14.52,76.03 14.33,75.84 C22.1 12.15,75.48 11.86,75.78 J10.2
  Top 0.813: J10.2 11.81,76.2 13.97,76.2 14.33,75.84 | C22.1 14.52,76.03 C21.1 18.45,76.03 18.66,75.81 | R10.P$1 20.05,76.43 22.36,76.43
  Top 1.27: J16.2 5.82,76.2 11.81,76.2
1V5  (via drill 0.35)
  Top 0.305: IC9.14 23.32,76.43 IC9.13 23.61,78.22 v24.13,78.74
  Top 0.813: R16.P$2 44.45,76.2 45.72,77.47 | 45.72,77.47 55.7,77.47 L8.2 62.56,76.71 C34.+ 70.06,76.71 C31.1 70.57,72.94 J9.1 | 45.72,77.47 v45.72,80.01 | v24.13,78.74 24.13,77.45 23.32,76.64 23.32,76.43
  Bottom 0.813: v24.13,78.74 25.4,80.01 v45.72,80.01
1V9DOUT
  Top 0.305: R22.P$1 20.63,50.03 20.83,50.23 21.31,50.23 IC11.1 IC11.16 22.4,51.03 IC11.15
  Top 0.813: J12.2 11.81,50.8 13.25,50.8 C29.1 14.52,50.63 C28.1 18.45,50.63 R22.P$1 20.27,50.03 21.2,50.96 22.33,50.96 22.4,51.03
  Top 1.27: J16.4 6.43,68.11 8.81,65.73 8.81,53.73 11.74,50.8 11.81,50.8
1V9OUT
  Top 0.305: R9.P$1 20.63,60.19 20.83,60.39 21.31,60.39 IC7.1 IC7.16 22.4,61.19 IC7.15 | 14.52,60.79 14.33,60.6 C20.1 12.15,60.24 11.73,60.65 J8.2
  Top 0.813: J8.2 13.81,60.96 13.97,60.96 14.33,60.6 | C20.1 14.52,60.79 C19.1 18.46,60.79 R9.P$1 20.27,60.19 21.2,61.12 22.33,61.12 22.4,61.19
  Top 1.27: J16.3 6.89,70.65 11.73,65.81 11.73,60.65
2V4  (via drill 0.35)
  Top 0.305: IC7.12 23.98,60.81 | 23.98,60.81 IC7.13 | IC7.13 IC7.14 | IC7.13 24.13,61.19 v24.13,63.5 | IC11.13 23.36,51.03 IC11.14 IC11.13 | 24.13,55.88 25.4,57.15 25.4,59.88 24.47,60.81 23.98,60.81 | IC11.12 IC11.13
  Top 0.813: R12.P$2 44.45,60.96 45.72,62.23 | 45.72,62.23 55.7,62.23 L6.2 62.56,61.47 C26.+ 70.06,61.47 C23.1 70.57,57.7 J7.1 | 45.72,62.23 v45.72,64.77 | v24.13,63.5 24.13,60.96 24.44,60.65 24.99,60.65 25.32,60.32 25.32,57.23 | 25.32,57.23 25.4,57.15 | 25.32,57.23 25.32,57.07 24.13,55.88 24.13,51.55 IC11.13 23.68,50.96 23.43,50.96 23.36,51.03
  Bottom 0.813: v45.72,64.77 25.4,64.77 v24.13,63.5
2V5-
  Top 0.813: J6.1 12.24,18.25 C14.1 17.66,18.25 IC5.5
  Top 1.27: J16.8 2.81,21.73 5.49,19.05 J6.1
2V5DOUT
  Top 0.305: 18.66,38.98 R24.P$1 20.63,38.6 20.83,38.8 21.31,38.8 IC14.1 IC14.16 22.4,39.6 IC14.15 | 14.52,39.2 14.33,39.01 C43.1 12.15,38.65 J15.2
  Top 0.813: J15.2 11.81,39.37 13.97,39.37 14.33,39.01 | C43.1 14.52,39.2 C38.1 18.45,39.2 18.66,38.98 | R24.P$1 20.05,39.6 22.4,39.6
  Top 1.27: 11.81,39.37 9.17,39.37 6.99,41.55 6.99,61.13 5.09,63.03 J16.6
2V5OUT
  Top 0.305: R17.P$1 19.36,27.17 19.56,27.38 20.04,27.38 IC12.1 IC12.16 21.13,28.17 IC12.15
  Top 0.813: J13.2 11.98,27.94 C35.1 13.25,27.77 C30.1 17.18,27.77 17.39,27.55 | 17.39,27.55 R17.P$1 | 17.39,27.55 19.38,27.55 19.93,28.1 21.06,28.1 21.13,28.17
  Top 1.27: J16.7 4.81,58.49 4.81,31.73 8.6,27.94 J13.2
2V8+  (via drill 0.35)
  Top 0.305: IC12.13 IC12.14 22.86,28.17 22.86,27.65 IC12.12
  Top 0.813: R1.P$2 44.45,26.67 45.72,27.94 55.7,27.94 L1.2 62.56,27.18 C6.+ 70.06,27.18 C5.1 | C5.1 70.57,23.41 J1.1 | 22.86,28.17 23.9,28.17 v24.13,27.94 | v68.58,30.48 70.57,28.49 C5.1
  Bottom 0.813: v24.13,27.94 26.67,30.48 v68.58,30.48
2V8-  (via drill 0.35)
  Top 0.813: IC2.6 34.92,10.79 IC2.9 36.83,11.43 36.83,12.7 38.1,13.97 44.62,13.97 44.62,11.43 | 44.62,11.43 44.62,8.68 D2.A 43.18,9.39 R4.P$1 | 44.62,11.43 52.07,11.43 55.88,7.62 55.88,5.08 57.15,3.81 65.28,3.81 C8.- 66.55,5.08 C9.2 70.81,5.32 70.81,5.61 71.12,5.92 J2.2 v68.58,8.89 | IC5.2 22.14,19.05 C27.1 22.56,19.05 v24.13,19.05
  Bottom 0.813: v24.13,19.05 26.67,19.05 30.48,15.24 67.31,15.24 68.58,13.97 v68.58,8.89
2V8D  (via drill 0.35)
  Top 0.305: IC14.12 IC14.13 | IC14.13 IC14.14 | IC14.13 24.13,39.6
  Top 0.813: R8.P$2 44.45,45.72 45.72,46.99 | 45.72,46.99 55.7,46.99 L4.2 62.56,46.23 C18.+ 70.06,46.23 C15.1 70.57,43.73 71.12,43.18 J5.1 | 24.13,39.6 24.13,41.91 v25.4,43.18 | v45.72,49.53 45.72,46.99
  Bottom 0.813: v45.72,49.53 31.75,49.53 v25.4,43.18
3V3OUT
  Top 0.305: R5.P$1 20.63,90.67 20.83,90.88 21.31,90.88 IC3.1 IC3.16 22.4,91.67 IC3.15 | C11.1 14.52,91.27 14.33,91.08 C12.1 | C12.1 12.15,90.72 11.97,90.9 J4.2 | D5.ANODE 13.99,90.74 C12.1
  Top 0.813: J4.2 13.97,91.44 | 14.33,91.08 13.97,91.44 | 13.97,91.44 16.34,91.44 C11.1 18.45,91.27 R5.P$1 20.27,90.67 21.2,91.6 22.33,91.6 22.4,91.67
  Top 1.27: 11.97,90.9 11.14,91.73 5.81,91.73 2.81,88.73 J16.1
3V7
  Top 0.305: IC3.14 IC3.13 IC3.12
  Top 0.406: R20.P$2 43.68,92.71 45.72,92.71
  Top 0.813: J11.1 70.57,88.18 C39.1 70.06,91.95 C42.+ 62.56,91.95 L10.2 55.7,92.71 45.72,92.71 45.72,96.04 28.4,96.04 23.97,91.6 23.68,91.6 IC3.13
BOOT1
  Top 0.305: IC1.1 35.1,20.32 C4.1
BOOT2
  Top 0.305: IC2.1 35.1,5.08 C7.1
BOOT3
  Top 0.508: 36.6,40.87 35.1,39.37 C17.1
  Top 0.813: IC4.1 36.6,40.87
BOOT4
  Top 0.508: 36.6,56.11 35.1,54.61 C25.1
  Top 0.813: IC6.1 36.6,56.11
BOOT5
  Top 0.508: 36.6,71.35 35.1,69.85 C33.1
  Top 0.813: IC8.1 36.6,71.35
BOOT6
  Top 0.508: 36.6,86.59 35.1,85.09 C41.1
  Top 0.813: IC10.1 36.6,86.59
FB1
  Top 0.305: R2.P$2 R6.P$1 40.78,27.3 IC1.4
FB2
  Top 0.305: IC2.4 39.62,12.07 40.26,11.43 R13.P$1 R4.P$2
FB3
  Top 0.406: R7.P$2 R21.P$1 40.78,46.35 40.01,46.35
  Top 0.813: 40.01,46.35 IC4.4
FB4
  Top 0.813: IC6.4 40.78,61.59 R12.P$1 R11.P$2
FB5
  Top 0.813: IC8.4 40.78,76.84 R16.P$1 R15.P$2
FB6
  Top 0.813: IC10.4 40.78,92.08 R20.P$1 R19.P$2
GND  (via drill 0.35)
  Top 0.305: J4.1 12.15,89.62 C12.2 16.06,89.62 C11.2 | 23.11,89.92 IC3.10 IC3.9 23.61,89.42 | J8.1 12.15,59.14 C20.2 16.06,59.14 C19.2 | J10.1 12.15,74.38 C22.2 16.06,74.38 C21.2 | IC7.6 IC7.7 | IC7.7 IC7.8 | IC7.8 23.98,58.56 | 23.98,58.56 IC7.9 | 23.11,59.44 23.61,58.94 | 23.61,58.94 23.98,58.56 | IC9.6 IC9.7 | IC9.7 IC9.8 23.61,74.18 IC9.17 23.11,74.68 IC9.7 | IC7.7 23.11,59.44 | 23.11,59.44 IC7.17 | v43.56,12.7 R3.P$2 | R2.P$1 v43.56,29.21 | 23.11,89.92 IC3.7 IC3.8 23.61,89.42 | 23.11,89.92 IC3.17 | 23.61,89.42 23.11,89.92 | IC7.8 IC7.9 | IC7.8 23.61,58.94 | IC7.9 23.61,58.94 | J13.1 10.88,26.12 C35.2 14.79,26.12 C30.2 | 21.84,26.42 IC12.7 IC12.8 22.34,25.92 22.03,26.23 21.84,26.42 | IC12.17 21.84,26.42 | IC12.10 21.84,26.42 | R18.P$1 v20.7,95.25 | J15.1 12.15,37.55 C43.2 16.06,37.55 C38.2 | R14.P$1 19.31,5.33 C10.2 | IC14.10 24.31,37.89 23.83,37.89 23.63,38.1 IC14.17
  Top 0.406: J12.1 12.15,48.98 C29.2 16.06,48.98 C28.2 | IC11.8 IC11.7 22.86,48.28 IC11.17
  Top 0.508: v73.66,5.08 C9.1
  Top 0.813: C1.2 28.66,24.85 v30.48,26.67 31.61,26.67 31.85,26.42 32.46,26.42 IC1.6 34.92,26.04 IC1.9 | C5.2 v73.66,26.67 | J1.2 66.04,20.32 C6.- | v27.94,7.62 27.94,8.17 C2.2 | C8.+ 70.36,10.67 J2.1 | D1.A 43.57,24.13 v45.72,24.13 | C16.2 28.66,43.9 v30.48,45.72 31.61,45.72 31.85,45.47 32.46,45.47 IC4.6 34.92,45.08 IC4.9 | D4.A 43.57,43.18 v45.72,43.18 | R7.P$1 v43.56,48.26 | C24.2 28.66,59.14 v30.48,60.96 31.61,60.96 31.85,60.71 32.46,60.71 IC6.6 34.92,60.32 IC6.9 | C23.2 v73.66,60.96 | J7.2 66.04,54.61 C26.- | D6.A 43.57,58.42 v45.72,58.42 | R11.P$1 v43.56,63.5 | C32.2 28.66,74.38 v30.48,76.2 31.61,76.2 31.85,75.95 32.46,75.95 IC8.6 34.92,75.56 IC8.9 | C31.2 v73.66,76.2 | J9.2 66.04,69.85 C34.- | D8.A 43.57,73.66 v45.72,73.66 | R15.P$1 v43.56,78.74 | C40.2 28.66,89.62 v30.48,91.44 31.61,91.44 31.85,91.19 32.46,91.19 IC10.6 34.92,90.81 IC10.9 | C39.2 v73.66,91.44 | J11.2 66.04,85.09 C42.- | D10.A 43.57,88.9 v45.72,88.9 | R19.P$1 v43.56,93.98 | C14.2 11.79,16.14 J6.2 | v13.46,20.32 C13.2 | C15.2 v73.53,45.72 | C18.- 67.82,40.13 68.58,39.37 J5.2 | IC12.17 22.11,26.15 v22.11,23.93 | v23.31,35.43 23.31,35.96 23.32,35.97 23.32,37.64 IC14.17 | IC9.17 23.31,74.48 v23.31,72.43 | IC7.17 23.31,59.24 v23.31,57.13
  Top 1.016: J3.1 6.91,6.99 CN1.GND 11.21,4.08 CN1.GNDBREAK 18.46,7.48 C10.2 | IC3.8 23.61,87.73 v23.31,87.43 23.31,87.89 23.42,88 23.42,89.61 IC3.17 | IC9.17 22.86,74.16 | C11.2 18.54,87.14 J19.1 | C21.2 18.54,71.9 J18.1 | C19.2 18.54,56.66 J17.1 | IC11.17 23.3,49.09 23.3,48.86 23.31,48.85 v23.31,46.83 | C38.2 16.51,35.33 v16.31,35.13 | C28.2 16.51,47.33 v16.31,47.13 | C30.2 15.31,25.6 v15.31,24.13 | IC12.17 22.03,26.23
  pour Bottom: -2.54,100.33 78.74,100.33 78.74,-1.27 -2.54,-1.27
  pour Top: -1.27,99.06 80.01,99.06 80.01,-2.54 -1.27,-2.54
N$1
  Top 0.305: R1.P$1 41.7,26.96 42.41,27.68 R6.P$2
N$2
  Top 0.305: R3.P$1 42.41,11.7 R13.P$2
N$3
  Top 1.016: C3.2 21.41,11.41 C10.1
N$4
  Top 0.813: IC5.4 17.48,20.32 C13.1
N$5
  Top 0.305: D3.CATHODE 20.8,3.78 R14.P$2
N$6
  Top 0.305: D5.CATHODE R18.P$2
N$7
  Top 0.406: R8.P$1 41.65,45.96 41.65,46.04 42.41,46.8 R21.P$2
N$8
  Top 0.305: J19.2 21.08,87.64 IC3.5
N$9
  Top 0.305: J18.2 21.08,72.4 IC9.5
N$10
  Top 0.305: IC7.5 22.11,58.31 21.73,57.94 21.73,57.81 | J17.2 21.08,57.16 21.73,57.81 | IC7.5 21.73,57.81 | IC7.5
PG1V1
  Top 0.305: IC9.3 19.3,74.68 R10.P$2
PG1V9  (via drill 0.35)
  Top 0.305: IC7.3 19.3,59.44 R9.P$2 18.55,59.69 v17.91,59.69 | v24.91,70.8 25.06,70.8 25.06,75.46 24.89,75.64 24.4,75.64 IC9.12
  Bottom 0.305: v24.91,70.8 24.91,66.69 v17.91,59.69
PG1V9D
  Top 0.305: IC11.3 19.3,49.28 R22.P$2
PG2V5D
  Top 0.305: IC14.3 19.3,37.85 R24.P$2
PG3V3
  Top 0.305: IC3.3 19.3,89.92 R5.P$2
PG25
  Top 0.305: IC12.3 18.03,26.42 R17.P$2
SW1
  Top 0.813: L1.1 45.02,19.44 D1.C 34.33,19.44 33.98,19.79 33.98,20.08 C4.2 32.85,21.21 IC1.8
SW2
  Top 0.813: IC2.8 33.02,8.08 33.02,5.8 C7.2 33.88,4.95 33.88,4.65 35.6,2.93 D2.C 46.6,6.35 49.53,6.35 49.71,6.53 L2.1
SW3
  Top 0.813: L4.1 45.02,38.49 D4.C 34.33,38.49 33.98,38.84 33.98,39.13 C17.2 32.85,40.26 IC4.8
SW4
  Top 0.813: L6.1 45.02,53.73 D6.C 34.33,53.73 33.98,54.08 33.98,54.37 C25.2 32.85,55.5 IC6.8
SW5
  Top 0.813: L8.1 45.02,68.97 D8.C 34.33,68.97 33.98,69.32 33.98,69.61 C33.2 32.85,70.74 IC8.8
SW6
  Top 0.813: L10.1 45.02,84.21 D10.C 34.33,84.21 33.98,84.56 33.98,84.85 C41.2 32.85,85.98 IC10.8
VIN
  Top 0.813: IC1.7 32.54,24.46 31.93,24.46 31.61,24.13 C1.1 29.62,24 29.62,23.71 28.78,22.86 26.67,22.86 | IC2.7 30.39,9.53 C2.1 29.76,9.61 29.21,10.16 26.67,10.16 26.67,18.73 26.67,22.86 | IC4.7 32.54,43.51 31.93,43.51 31.61,43.18 C16.1 29.62,43.04 29.62,42.75 28.78,41.91 26.67,41.91 | IC6.7 32.54,58.75 31.93,58.75 31.61,58.42 C24.1 29.62,58.28 29.62,57.99 28.78,57.15 26.67,57.15 | IC8.7 32.54,73.99 31.93,73.99 31.61,73.66 C32.1 29.62,73.53 29.62,73.23 28.78,72.39 26.67,72.39 | IC10.7 32.54,89.23 31.93,89.23 31.61,88.9 C40.1 29.62,88.77 29.62,88.48 28.78,87.63 26.67,87.63 26.67,72.39 | 26.67,22.86 26.67,41.91 | 26.67,41.91 26.67,57.15 | 26.67,57.15 26.67,72.39
  Top 1.016: J3.2 3.42,10.33 CN1.PWR 10.91,11.43 C3.1 20.17,12.27 20.17,12.38 26.52,18.73 26.67,18.73 | D3.ANODE 24.81,5.29 24.81,5.73 26.67,7.59 26.67,10.16

### Text on the board
tPlace: 3.3V | Haasoscope Pro / Power board, v1.11 / by Dr. Andy Haas | + | 3.7V / out / GND | GND | - | +0.1V | 1.1V | + | 3V3 | 1.1V | 1.5V / out / GND | GND | 1.9V | - | +0.1V | 1.9VD | GND | 2.5VD | 1.9V | + | 2v5+ | 2v5- | 2.4V / out / GND | GND | - | +0.1V | 1.9VD / out / GND | + | 2.8VD / out / GND | - | 2.5VD / out / GND | 2.5V / out / GND | + | 2.8V+ / out / GND | - | -2.5V / out / GND | 12V in | GND / 2.8V- / out | + | GND | -